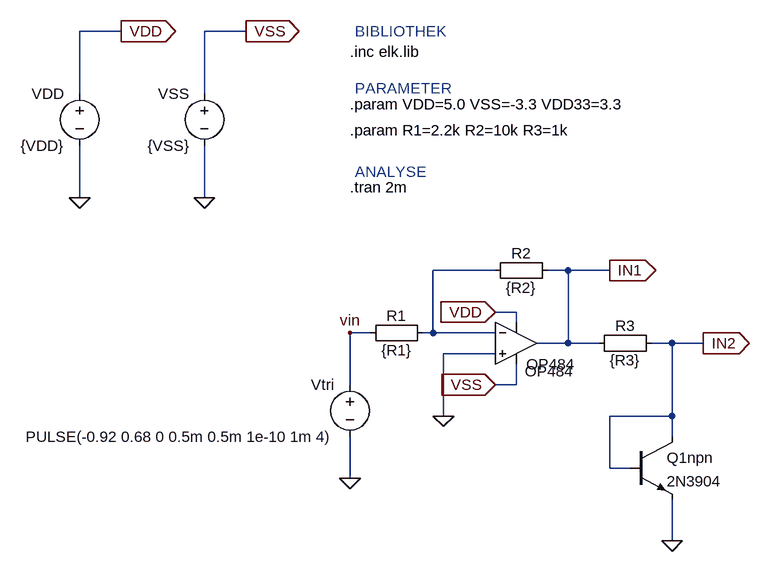
[diagram p0: schematic Activity_22_NPN.asc]
Activity_22_NPN.asc, the LTspice schematic file:
Version 4
SHEET 1 1408 680
WIRE -1504 -304 -1568 -304
WIRE -1312 -304 -1376 -304
WIRE -1568 -208 -1568 -304
WIRE -1376 -208 -1376 -304
WIRE -1568 -48 -1568 -128
WIRE -1376 -48 -1376 -128
WIRE -928 64 -1024 64
WIRE -816 64 -848 64
WIRE -752 64 -816 64
WIRE -896 128 -928 128
WIRE -896 144 -896 128
WIRE -1120 160 -1152 160
WIRE -1024 160 -1024 64
WIRE -1024 160 -1040 160
WIRE -928 160 -1024 160
WIRE -816 176 -816 64
WIRE -816 176 -864 176
WIRE -768 176 -816 176
WIRE -656 176 -688 176
WIRE -608 176 -656 176
WIRE -928 192 -1008 192
WIRE -1152 240 -1152 160
WIRE -896 240 -896 208
WIRE -896 240 -928 240
WIRE -1008 288 -1008 192
WIRE -656 288 -656 176
WIRE -656 288 -752 288
WIRE -656 320 -656 288
WIRE -752 368 -752 288
WIRE -720 368 -752 368
WIRE -1152 384 -1152 320
WIRE -656 480 -656 416
FLAG -928 128 VDD
IOPIN -928 128 In
FLAG -928 240 VSS
IOPIN -928 240 In
FLAG -656 480 0
FLAG -1008 288 0
FLAG -1568 -48 0
FLAG -1504 -304 VDD
IOPIN -1504 -304 Out
FLAG -1376 -48 0
FLAG -1312 -304 VSS
IOPIN -1312 -304 Out
FLAG -608 176 IN2
IOPIN -608 176 Out
FLAG -752 64 IN1
IOPIN -752 64 Out
FLAG -1152 384 0
FLAG -1152 160 vin
SYMBOL npn -720 320 R0
SYMATTR InstName Q1npn
SYMATTR Value 2N3904
SYMATTR Prefix ""
SYMBOL UniversalOpamp2 -896 176 R0
WINDOW 0 13 43 Left 2
SYMATTR InstName OP484
SYMATTR SpiceModel ""
SYMATTR Value2 ""
SYMATTR SpiceLine ""
SYMATTR SpiceLine2 ""
SYMATTR Value OP484
SYMBOL voltage -1568 -224 M0
WINDOW 123 24 124 Left 2
WINDOW 39 0 0 Left 2
SYMATTR InstName VDD
SYMATTR Value {VDD}
SYMBOL voltage -1376 -224 M0
WINDOW 123 24 124 Left 2
WINDOW 39 0 0 Left 2
SYMATTR InstName VSS
SYMATTR Value {VSS}
SYMBOL voltage -1152 224 M0
WINDOW 123 0 0 Left 0
WINDOW 39 0 0 Left 0
SYMATTR InstName Vtri
SYMATTR Value PULSE(-0.92 0.68 0 0.5m 0.5m 1e-10 1m 4)
SYMBOL Misc/EuropeanResistor -1024 144 R90
WINDOW 0 5 56 VBottom 2
WINDOW 3 27 56 VTop 2
SYMATTR InstName R1
SYMATTR Value {R1}
SYMBOL Misc/EuropeanResistor -832 48 R90
WINDOW 0 5 56 VBottom 2
WINDOW 3 27 56 VTop 2
SYMATTR InstName R2
SYMATTR Value {R2}
SYMBOL Misc/EuropeanResistor -672 160 R90
WINDOW 0 5 56 VBottom 2
WINDOW 3 27 56 VTop 2
SYMATTR InstName R3
SYMATTR Value {R3}
TEXT -1152 -272 Left 2 !.inc elk.lib
TEXT -1152 -192 Left 2 !.param VDD=5.0 VSS=-3.3 VDD33=3.3
TEXT -1152 -64 Left 2 !.tran 2m
TEXT -1152 -152 Left 2 !.param R1=2.2k R2=10k R3=1k
TEXT -1144 -304 Left 2 ;BIBLIOTHEK
TEXT -1144 -216 Left 2 ;PARAMETER
TEXT -1144 -88 Left 2 ;ANALYSE

The netlist it stands for:
* Activity_22_NPN.asc
XQ1npn IN2 IN2 0 2N3904  ; pins C B E
XOP484 0 N001 VDD VSS IN1 OP484  ; pins IN+ IN- V+ V- OUT
VDD VDD 0 {VDD}
VSS VSS 0 {VSS}
Vtri vin 0 PULSE(-0.92 0.68 0 0.5m 0.5m 1e-10 1m 4)
R1 N001 vin {R1}
R2 IN1 N001 {R2}
R3 IN2 IN1 {R3}
.inc elk.lib
.param VDD=5.0 VSS=-3.3 VDD33=3.3
.tran 2m
.param R1=2.2k R2=10k R3=1k
* BIBLIOTHEK
* PARAMETER
* ANALYSE
.lib UniversalOpamps2.sub
.backanno
.end